# Altium project Motor_Driver_Module.PrjPCB
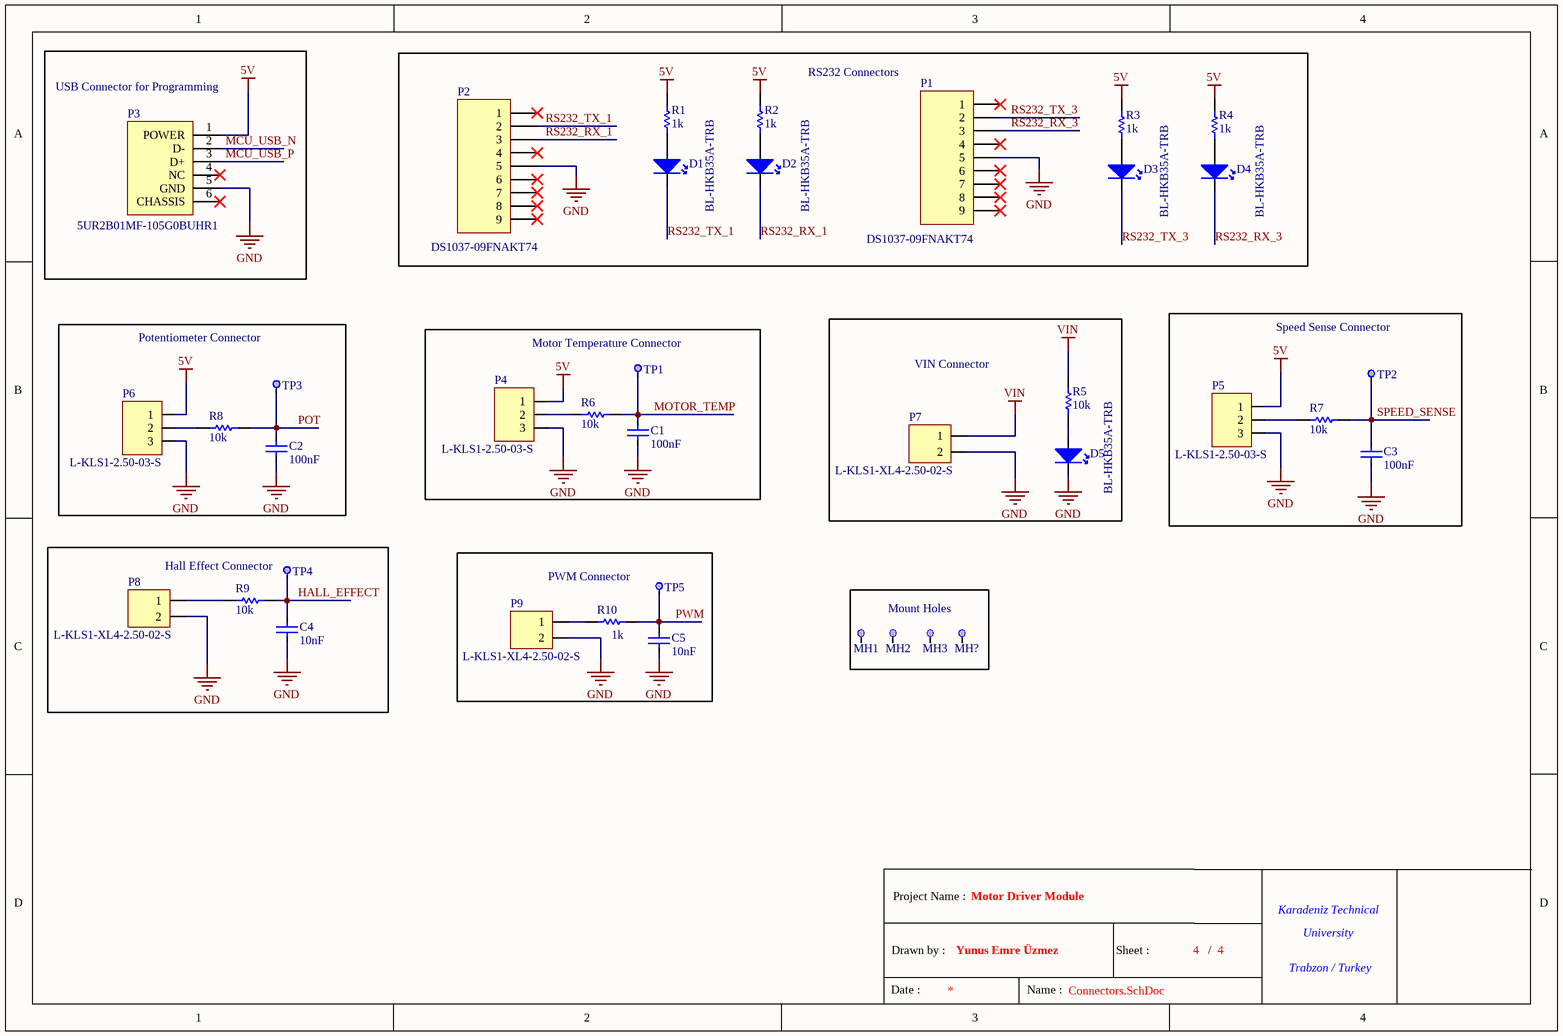
[diagram p0: Connectors.SchDoc]
Person: Yunus Emre Üzmez; Project: Motor Driver Module
4 sheets, 92 parts. Net scope: global (net labels, ports and power ports of the same name join across sheets).
Board file: Motor_Driver_Module.PcbDoc
Sheets:
  Connectors.SchDoc
  Peripheral.SchDoc
  MCU.SchDoc
  Power.SchDoc

## Sheet Connectors.SchDoc
size A4; DocumentNumber: 4; SheetNumber: 4; SheetTotal: 4

### Parts
(Parts that share a designator on the sheet are numbered #1, #2 ... from top to bottom, then left to right.)
?#1  (no value)  (graphical)
C1  100nF  [CAP-0603]
C2  100nF  [CAP-0603]
C3  100nF  [CAP-0603]
C4  10nF  [CAP-0603]
C5  10nF  [CAP-0603]
D1  BL-HKB35A-TRB  [LED-0805]
D2  BL-HKB35A-TRB  [LED-0805]
D3  BL-HKB35A-TRB  [LED-0805]
D4  BL-HKB35A-TRB  [LED-0805]
D5  BL-HKB35A-TRB  [LED-0805]
MH1  3mm Mounting Hole  [3mm Mounting Hole]  (value not drawn)  (no BOM)
MH2  3mm Mounting Hole  [3mm Mounting Hole]  (value not drawn)  (no BOM)
MH3  3mm Mounting Hole  [3mm Mounting Hole]  (value not drawn)  (no BOM)
MH?  3mm Mounting Hole  [3mm Mounting Hole]  (value not drawn)  (no BOM)
P1  DS1037-09FNAKT74  [D SUB 9PIN FEMALE 90C TH]
P2  DS1037-09FNAKT74  [D SUB 9PIN FEMALE 90C TH]
P3  5UR2B01MF-105G0BUHR1  [MICRO USB B SMD]
P4  L-KLS1-2.50-03-S  [3PIN MALE 180C TH 2.5mm]
P5  L-KLS1-2.50-03-S  [3PIN MALE 180C TH 2.5mm]
P6  L-KLS1-2.50-03-S  [3PIN MALE 180C TH 2.5mm]
P7  L-KLS1-XL4-2.50-02-S  [2 PIN MALE 180C TH 2.50MM]
P8  L-KLS1-XL4-2.50-02-S  [2 PIN MALE 180C TH 2.50MM]
P9  L-KLS1-XL4-2.50-02-S  [2 PIN MALE 180C TH 2.50MM]
R1  1k  [RES-0603]
R2  1k  [RES-0603]
R3  1k  [RES-0603]
R4  1k  [RES-0603]
R5  10k  [RES-0603]
R6  10k  [RES-0603]
R7  10k  [RES-0603]
R8  10k  [RES-0603]
R9  10k  [RES-0603]
R10  1k  [RES-0603]
TP1  Test Point  [0.8mm Test Point]  (value not drawn)  (no BOM)
TP2  Test Point  [0.8mm Test Point]  (value not drawn)  (no BOM)
TP3  Test Point  [0.8mm Test Point]  (value not drawn)  (no BOM)
TP4  Test Point  [0.8mm Test Point]  (value not drawn)  (no BOM)
TP5  Test Point  [0.8mm Test Point]  (value not drawn)  (no BOM)

### Blocks framed on the sheet
USB Connector for Programming: P3
RS232 Connectors: D1-D4 P1 P2 R1-R4
Potentiometer Connector: C2 P6 R8 TP3
Motor Temperature Connector: C1 P4 R6 TP1
VIN Connector: D5 P7 R5
Speed Sense Connector: C3 P5 R7 TP2
Hall Effect Connector: C4 P8 R9 TP4
PWM Connector: C5 P9 R10 TP5
Mount Holes: MH1-MH3 MH?

### Nets
5V: P3.1(POWER) P4.1 P5.1 P6.1 R1.2 R2.2 R3.2 R4.2
GND: C1.1 C2.1 C3.1 C4.1 C5.2 D5.2(K) P1.5 P2.5 P3.5(GND) P4.3 P5.3 P6.3 P7.2 P8.2 P9.2
VIN: P7.1 R5.2
HALL_EFFECT: C4.2 R9.2 TP4.1
MCU_USB_N: P3.2(D-)
MCU_USB_P: P3.3(D+)
MOTOR_TEMP: C1.2 R6.2 TP1.1
POT: C2.2 R8.2 TP3.1
PWM: C5.1 R10.2 TP5.1
RS232_RX_1: D2.2(K) P2.3
RS232_RX_3: D4.2(K) P1.3
RS232_TX_1: D1.2(K) P2.2
RS232_TX_3: D3.2(K) P1.2
SPEED_SENSE: C3.2 R7.2 TP2.1
NetD1_1: D1.1(A) R1.1
NetD2_1: D2.1(A) R2.1
NetD3_1: D3.1(A) R3.1
NetD4_1: D4.1(A) R4.1
NetD5_1: D5.1(A) R5.1
NetP4_2: P4.2 R6.1
NetP5_2: P5.2 R7.1
NetP6_2: P6.2 R8.1
NetP8_1: P8.1 R9.1
NetP9_1: P9.1 R10.1

Not connected (* = marked no-connect by the designer): MH1 1; MH2 1; MH3 1; MH? 1; P1 1* 4* 6* 7* 8* 9*; P2 1* 4* 6* 7* 8* 9*; P3 4(NC)* 6(CHASSIS)*

### Notes on the sheet
- Project Name :
- Karadeniz Technical
- Date :
- Drawn by :
- Name :
- Sheet :
- /
- University
- Trabzon / Turkey

### Library data of the parts
?#1 = Title Block: Standart Title Block
C1-C3 = CGA3E2X7R1H104K080AA: Manufacturer: TDK; Temperature Coefficient: X7R; Voltage: 50V; Library Reference: Capacitor; Tolerance: %10; Man Code: CGA3E2X7R1H104K080AA; Value: 100nF; Footprint: 0603; Component Type: Ceramic Capacitor
C4 C5 = 06031C103K4T4A: Manufacturer: AVX; Temperature Coefficient: X7R; Voltage: 100V; Library Reference: Capacitor; Tolerance: %10; Man Code: 06031C103K4T4A; Value: 10nF; Footprint: 0603; Component Type: Ceramic Capacitor
D1-D5 = BL-HKB35A-TRB: Manufacturer: BRIGHT LED; Colour: Yellow; Vf: 2.2V; Library Reference: Miscellaneous; Luminous Intensity: 94mcd; If: 20mA; Lens Transparency: Water Clear; Man Code: BL-HKB35A-TRB; Footprint: 0805; Component Type: Led
MH1-MH3 MH? = 3mm Mounting Hole: Library Reference: Miscellaneous; Component Type: Mounting Hole
P1 P2 = DS1037-09FNAKT74: Manufacturer: CONNFLY; Library Reference: Connector; Mating Connector: L-KLS1-213-09-M-L; Gender: Female; Contact Number: 9; Number of Row: 2; Mounting Angle: 90; Current(max): 1.5A; Contact Resistance(max): 20mohm; Pitch: 2.77mm; Man Code: DS1037-09FNAKT74; Component Type: D SUB 9 PIN Female Connector; Mounting Style: Through Hole
P3 = 5UR2B01MF-105G0BUHR1: Manufacturer: AMTEK; Library Reference: Connector; Mating Connector: MICRO USB B; Gender: Female; Contact Number: 5; Number of Row: 1; Mounting Angle: 90; Current(max): 1A; Contact Resistance(max): 30mohm; Pitch: 0.65mm; Man Code: 5UR2B01MF-105G0BUHR1; Component Type: MICRO USB B Connector; Mounting Style: SMD
P4-P6 = L-KLS1-2.50-03-S: Manufacturer: KLS ELECTRONIC; Library Reference: Connector; Mating Connector: L-KLS1-2.50-03-H; Gender: Male; Contact Number: 3; Number of Row: 1; Mounting Angle: 180; Current(max): 3A; Contact Resistance(max): 10mohm; Pitch: 2.5mm; Man Code: L-KLS1-2.50-03-S; Component Type: CONN 3PIN MALE 180C TH 2.5mm; Mounting Style: Through Hole
P7-P9 = L-KLS1-XL4-2.50-02-S: Manufacturer: KLS ELECTRONIC; Contact Number: 3; Contact Resistance (Max): 10mohm; Current(Max): 3A; Gender: Male; Mounting Angle: 180; Number of Row: 1; Pitch: 2.50mm; Component Type: CONN 2PIN MALE 180C TH 2.5mm; Mounting Style: THT; Man Code: L-KLS1-XL4-2.50-02-S
R1-R4 = CRCW06031K00FKEAC: Manufacturer: Vishay; Tolerance: %1; Power: 0.1W; Library Reference: Resistor; Man Code: CRCW06031K00FKEAC; Value: 1k; Footprint: 0603; Component Type: Chip Resistor
R5-R9 = CRCW060310K0FKEA: Manufacturer: Vishay; Tolerance: %1; Power: 0.1W; Library Reference: Resistor; Man Code: CRCW060310K0FKEA; Value: 10k; Footprint: 0603; Component Type: Chip Resistor
R10 = CRCW06031K00FKEAC: Manufacturer: Vishay; Library Reference: Resistor; Tolerance: %1; Power: 0.1W; Man Code: CRCW06031K00FKEAC; Footprint: 0603; Component Type: Chip Resistor; Value: 1k
TP1-TP5 = Test Point: Library Reference: Miscellaneous; Component Type: Test Point

## Sheet Peripheral.SchDoc
size A4; DocumentNumber: 3; SheetNumber: 3; SheetTotal: 4
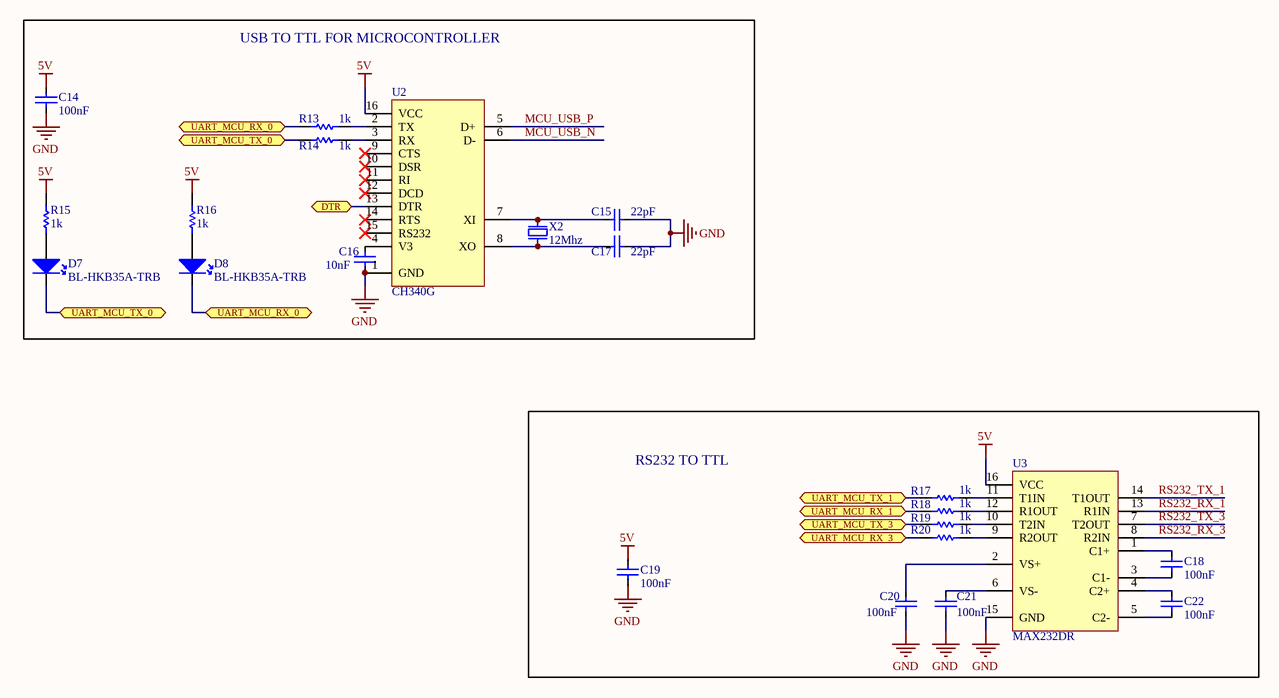
[diagram p1: Peripheral.SchDoc]

### Parts
(Parts that share a designator on the sheet are numbered #1, #2 ... from top to bottom, then left to right.)
?#2  (no value)  (graphical)
C14  100nF  [CAP-0603]
C15  22pF  [CAP-0805]
C16  10nF  [CAP-0603]
C17  22pF  [CAP-0805]
C18  100nF  [CAP-0603]
C19  100nF  [CAP-0603]
C20  100nF  [CAP-0603]
C21  100nF  [CAP-0603]
C22  100nF  [CAP-0603]
D7  BL-HKB35A-TRB  [LED-0805]
D8  BL-HKB35A-TRB  [LED-0805]
R13  1k  [RES-0603]
R14  1k  [RES-0603]
R15  1k  [RES-0603]
R16  1k  [RES-0603]
R17  1k  [RES-0603]
R18  1k  [RES-0603]
R19  1k  [RES-0603]
R20  1k  [RES-0603]
U2  CH340G  [16-SOIC_CH340G]
U3  MAX232DR  [16-SOIC_MAX232DR]
X2  12Mhz  [OSC-THT (11.5*5.00*3.60)]

### Blocks framed on the sheet
USB TO TTL FOR MICROCONTROLLER: C14-C17 D7 D8 R13-R16 U2 X2
RS232 TO TTL: C18-C22 R17-R20 U3

### Ports
DTR (bidir), UART_MCU_RX_0 (bidir), UART_MCU_RX_1 (bidir), UART_MCU_RX_3 (bidir), UART_MCU_TX_0 (bidir), UART_MCU_TX_1 (bidir), UART_MCU_TX_3 (bidir)

### Nets
5V: C14.2 C19.2 R15.2 R16.2 U2.16(VCC) U3.16(VCC)
GND: C14.1 C15.1 C16.1 C17.1 C19.1 C20.1 C21.1 U2.1(GND) U3.15(GND)
MCU_USB_N: U2.6(D-)
MCU_USB_P: U2.5(D+)
RS232_RX_1: U3.13(R1IN)
RS232_RX_3: U3.8(R2IN)
RS232_TX_1: U3.14(T1OUT)
RS232_TX_3: U3.7(T2OUT)
NetC8_2: U2.13(DTR) ; port DTR
NetC15_2: C15.2 U2.7(XI) X2.2
NetC16_2: C16.2 U2.4(V3)
NetC17_2: C17.2 U2.8(XO) X2.1
NetC18_1: C18.1 U3.3(C1-)
NetC18_2: C18.2 U3.1(C1+)
NetC20_2: C20.2 U3.2(VS+)
NetC21_2: C21.2 U3.6(VS-)
NetC22_1: C22.1 U3.5(C2-)
NetC22_2: C22.2 U3.4(C2+)
NetD7_1: D7.1(A) R15.1
NetD7_2: D7.2(K) R14.2 ; port UART_MCU_TX_0
NetD8_1: D8.1(A) R16.1
NetD8_2: D8.2(K) R13.2 ; port UART_MCU_RX_0
NetR13_1: R13.1 U2.2(TX)
NetR14_1: R14.1 U2.3(RX)
NetR17_1: R17.1 U3.11(T1IN)
NetR17_2: R17.2 ; port UART_MCU_TX_1
NetR18_1: R18.1 U3.12(R1OUT)
NetR18_2: R18.2 ; port UART_MCU_RX_1
NetR19_1: R19.1 U3.10(T2IN)
NetR19_2: R19.2 ; port UART_MCU_TX_3
NetR20_1: R20.1 U3.9(R2OUT)
NetR20_2: R20.2 ; port UART_MCU_RX_3

Not connected (* = marked no-connect by the designer): U2 9(CTS)* 10(DSR)* 11(RI)* 12(DCD)* 14(RTS)* 15(RS232)*

### Notes on the sheet
- Project Name :
- Karadeniz Technical
- Date :
- Drawn by :
- Name :
- Sheet :
- /
- University
- Trabzon / Turkey

### Library data of the parts
?#2 = Title Block: Standart Title Block
C14 C18-C22 = CGA3E2X7R1H104K080AA: as C1 on sheet Connectors; Man Code: CGA3E2X7R1H104K080AA; Value: 100nF; Footprint: 0603; Component Type: Ceramic Capacitor
C15 C17 = CL21C220JBANNNC: Manufacturer: Samsung Electro-Mechanics; Temperature Coefficient: C0G; Voltage: 50V; Library Reference: Capacitor; Tolerance: %5; Man Code: CL21C220JBANNNC; Value: 22pF; Footprint: 0805; Component Type: Ceramic Capacitor
C16 = 06031C103K4T4A: as C4 on sheet Connectors; Man Code: 06031C103K4T4A; Value: 10nF; Footprint: 0603; Component Type: Ceramic Capacitor
D7 D8 = BL-HKB35A-TRB: as D1 on sheet Connectors; Man Code: BL-HKB35A-TRB; Footprint: 0805; Component Type: Led
R13-R20 = CRCW06031K00FKEAC: as R1 on sheet Connectors; Man Code: CRCW06031K00FKEAC; Value: 1k; Footprint: 0603; Component Type: Chip Resistor
U2 = CH340G: Library Reference: Integrated_Circuit; Man Code: CH340G; Footprint: 16-SOIC; Component Type: USB-TTL Converter
U3 = MAX232DR: Manufacturer: Texas Instruments; Library Reference: Integrated_Circuit; Data Rate: 120Kbps; Supply Voltage: 4.5V - 5.5V; Man Code: MAX232DR; Footprint: 16-SOIC; Component Type: RS-232 Transceiver
X2 = AS49S-12M-FC160F3: Manufacturer: ANSEN; Frequency Tolerance: 20ppm; Frequency Stability: 50ppm; Library Reference: Miscellaneous; Capacitance: 16pF; ESR: 40ohm; Man Code: AS49S-12M-FC160F3; Value: 12Mhz; Footprint: THT (11.5*5.00*3.60); Component Type: Crystal Oscillator

## Sheet MCU.SchDoc
size A4; DocumentNumber: 1; SheetNumber: 1; SheetTotal: 4
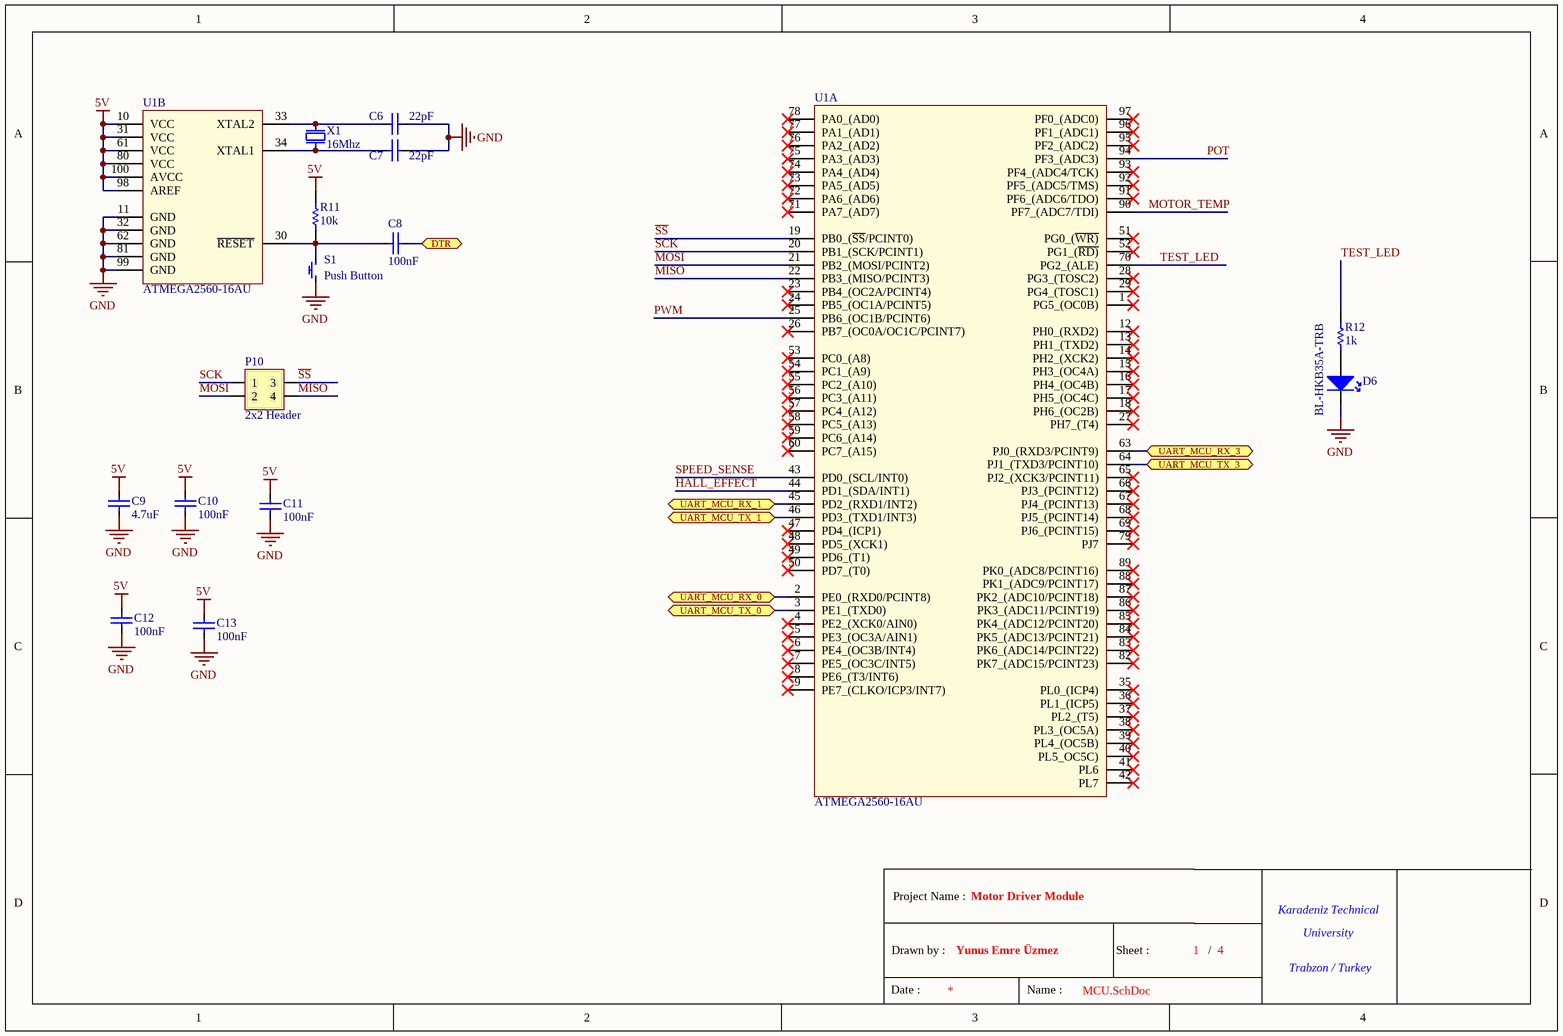
[diagram p2: MCU.SchDoc]

### Parts
(Parts that share a designator on the sheet are numbered #1, #2 ... from top to bottom, then left to right.)
?#3  (no value)  (graphical)
C6  22pF  [CAP-0805]
C7  22pF  [CAP-0805]
C8  100nF  [CAP-0603]
C9  4.7uF  [CAP-0805]
C10  100nF  [CAP-0603]
C11  100nF  [CAP-0603]
C12  100nF  [CAP-0603]
C13  100nF  [CAP-0603]
D6  BL-HKB35A-TRB  [LED-0805]
P10  2x2 Header  [2x2 Header (2.54mm)]
R11  10k  [RES-0603]
R12  1k  [RES-0603]
S1  Push Button  [2.54mm_Push Button]  (no BOM)
U1  ATMEGA2560-16AU  [TQFP-100 Microchip]  (parts A,B of 2)
X1  16Mhz  [OSC-THT (11.5*5.00*3.60)]

### Ports
DTR (bidir), UART_MCU_RX_0 (bidir), UART_MCU_RX_1 (bidir), UART_MCU_RX_3 (bidir), UART_MCU_TX_0 (bidir), UART_MCU_TX_1 (bidir), UART_MCU_TX_3 (bidir)

### Nets
5V: C9.2 C10.2 C11.2 C12.2 C13.2 R11.2 U1.10(VCC) U1.31(VCC) U1.61(VCC) U1.80(VCC) U1.98(AREF) U1.100(AVCC)
GND: C6.1 C7.1 C9.1 C10.1 C11.1 C12.1 C13.1 D6.2(K) S1.1 U1.11(GND) U1.32(GND) U1.62(GND) U1.81(GND) U1.99(GND)
HALL_EFFECT: U1.44(PD1_(SDA/INT1))
MISO: P10.4 U1.22(PB3_(MISO/PCINT3))
MOSI: P10.2 U1.21(PB2_(MOSI/PCINT2))
MOTOR_TEMP: U1.90(PF7_(ADC7/TDI))
POT: U1.94(PF3_(ADC3))
PWM: U1.25(PB6_(OC1B/PCINT6))
~{SS}: P10.3 U1.19(PB0_(~{SS}/PCINT0))
SCK: P10.1 U1.20(PB1_(SCK/PCINT1))
SPEED_SENSE: U1.43(PD0_(SCL/INT0))
TEST_LED: R12.2 U1.70(PG2_(ALE))
NetC6_2: C6.2 U1.33(XTAL2) X1.2
NetC7_2: C7.2 U1.34(XTAL1) X1.1
NetC8_1: C8.1 R11.1 S1.2 U1.30(~{RESET})
NetC8_2: C8.2 ; port DTR
NetD6_1: D6.1(A) R12.1
NetD7_2: U1.3(PE1_(TXD0)) ; port UART_MCU_TX_0
NetD8_2: U1.2(PE0_(RXD0/PCINT8)) ; port UART_MCU_RX_0
NetR17_2: U1.46(PD3_(TXD1/INT3)) ; port UART_MCU_TX_1
NetR18_2: U1.45(PD2_(RXD1/INT2)) ; port UART_MCU_RX_1
NetR19_2: U1.64(PJ1_(TXD3/PCINT10)) ; port UART_MCU_TX_3
NetR20_2: U1.63(PJ0_(RXD3/PCINT9)) ; port UART_MCU_RX_3

Not connected (* = marked no-connect by the designer): U1 1(PG5_(OC0B))* 4(PE2_(XCK0/AIN0))* 5(PE3_(OC3A/AIN1))* 6(PE4_(OC3B/INT4))* 7(PE5_(OC3C/INT5))* 8(PE6_(T3/INT6))* 9(PE7_(CLKO/ICP3/INT7))* 12(PH0_(RXD2))* 13(PH1_(TXD2))* 14(PH2_(XCK2))* 15(PH3_(OC4A))* 16(PH4_(OC4B))* 17(PH5_(OC4C))* 18(PH6_(OC2B))* 23(PB4_(OC2A/PCINT4))* 24(PB5_(OC1A/PCINT5))* 26(PB7_(OC0A/OC1C/PCINT7))* 27(PH7_(T4))* 28(PG3_(TOSC2))* 29(PG4_(TOSC1))* 35(PL0_(ICP4))* 36(PL1_(ICP5))* 37(PL2_(T5))* 38(PL3_(OC5A))* 39(PL4_(OC5B))* 40(PL5_OC5C))* 41(PL6)* 42(PL7)* 47(PD4_(ICP1))* 48(PD5_(XCK1))* 49(PD6_(T1))* 50(PD7_(T0))* 51(PG0_(~{WR)})* 52(PG1_(~{RD)})* 53(PC0_(A8))* 54(PC1_(A9))* 55(PC2_(A10))* 56(PC3_(A11))* 57(PC4_(A12))* 58(PC5_(A13))* 59(PC6_(A14))* 60(PC7_(A15))* 65(PJ2_(XCK3/PCINT11))* 66(PJ3_(PCINT12))* 67(PJ4_(PCINT13))* 68(PJ5_(PCINT14))* 69(PJ6_(PCINT15))* 71(PA7_(AD7))* 72(PA6_(AD6))* 73(PA5_(AD5))* 74(PA4_(AD4))* 75(PA3_(AD3))* 76(PA2_(AD2))* 77(PA1_(AD1))* 78(PA0_(AD0))* 79(PJ7)* 82(PK7_(ADC15/PCINT23))* 83(PK6_(ADC14/PCINT22))* 84(PK5_(ADC13/PCINT21))* 85(PK4_(ADC12/PCINT20))* 86(PK3_(ADC11/PCINT19))* 87(PK2_(ADC10/PCINT18))* 88(PK1_(ADC9/PCINT17))* 89(PK0_(ADC8/PCINT16))* 91(PF6_(ADC6/TDO))* 92(PF5_(ADC5/TMS))* 93(PF4_(ADC4/TCK))* 95(PF2_(ADC2))* 96(PF1_(ADC1))* 97(PF0_(ADC0))*

### Notes on the sheet
- Project Name :
- Karadeniz Technical
- Date :
- Drawn by :
- Name :
- Sheet :
- /
- University
- Trabzon / Turkey

### Library data of the parts
?#3 = Title Block: Standart Title Block
C6 C7 = CL21C220JBANNNC: as C15 on sheet Peripheral; Man Code: CL21C220JBANNNC; Value: 22pF; Footprint: 0805; Component Type: Ceramic Capacitor
C8 C10-C13 = CGA3E2X7R1H104K080AA: as C1 on sheet Connectors; Man Code: CGA3E2X7R1H104K080AA; Value: 100nF; Footprint: 0603; Component Type: Ceramic Capacitor
C9 = C0805C475K3RACAUTO: Manufacturer: Kemet; Temperature Coefficient: X7R; Voltage: 25V; Library Reference: Capacitor; Tolerance: %10; Man Code: C0805C475K3RACAUTO; Value: 4.7uF; Footprint: 0805; Component Type: Ceramic Capacitor
D6 = BL-HKB35A-TRB: as D1 on sheet Connectors; Man Code: BL-HKB35A-TRB; Footprint: 0805; Component Type: Led
P10 = 2x2 Header (2.54mm): Library Reference: Connector; Gender: Male; Contact Number: 4; Number of Row: 2; Mounting Angle: 180; Pitch: 2.54mm; Man Code: 2x2 Header; Component Type: Header; Manufacturer: -; Mating Connector: -; Mounting Style: Through Hole; Current(max): -; Contact Resistance(max): -
R11 = CRCW060310K0FKEA: as R5 on sheet Connectors; Man Code: CRCW060310K0FKEA; Value: 10k; Footprint: 0603; Component Type: Chip Resistor
R12 = CRCW06031K00FKEAC: as R1 on sheet Connectors; Man Code: CRCW06031K00FKEAC; Value: 1k; Footprint: 0603; Component Type: Chip Resistor
S1 = Push Button: Library Reference: Other Switches; Component Type: Push Button
U1 = ATMEGA2560-16AU: Manufacturer: Microchip; Library Reference: Integrated_Circuit; Number Of Bits: 8-Bit; Speed: 16Mhz; Program Memory Size: 256KB; Supply Voltage: 4.5V - 5.5V; Component Type: Microcontroller; Man Code: ATMEGA2560-16AU
X1 = AS49S-16M-FC160F3: Manufacturer: ANSEN; Frequency Tolerance: 20ppm; Frequency Stability: 50ppm; Library Reference: Miscellaneous; Capacitance: 16pF; ESR: 30ohm; Man Code: AS49S-16M-FC160F3; Value: 16Mhz; Component Type: Crystal Oscillator; Footprint: THT (11.5*5.00*3.60)

## Sheet Power.SchDoc
size A4; DocumentNumber: 2; SheetNumber: 2; SheetTotal: 4
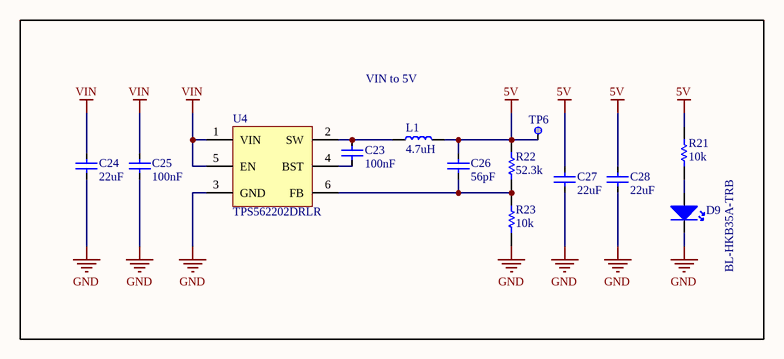
[diagram p3: Power.SchDoc]

### Parts
(Parts that share a designator on the sheet are numbered #1, #2 ... from top to bottom, then left to right.)
?#4  (no value)  (graphical)
C23  100nF  [CAP-0603]
C24  22uF  [CAP-1210]
C25  100nF  [CAP-0603]
C26  56pF  [CAP-0603]
C27  22uF  [CAP-1210]
C28  22uF  [CAP-1210]
D9  BL-HKB35A-TRB  [LED-0805]
L1  4.7uH  [IND_EATON_DR125-4R7-R]
R21  10k  [RES-0603]
R22  52.3k  [RES-0603]
R23  10k  [RES-0603]
TP6  Test Point  [0.8mm Test Point]  (value not drawn)  (no BOM)
U4  TPS562202DRLR  [SOT-563]

### Blocks framed on the sheet
VIN to 5V: C23-C28 D9 L1 R21-R23 TP6 U4

### Nets
5V: C26.2 C27.2 C28.2 L1.2 R21.2 R22.2 TP6.1
GND: C24.1 C25.1 C27.1 C28.1 D9.2(K) R23.1 U4.3(GND)
VIN: C24.2 C25.2 U4.1(VIN) U4.5(EN)
NetC23_1: C23.1 U4.4(BST)
NetC23_2: C23.2 L1.1 U4.2(SW)
NetC26_1: C26.1 R22.1 R23.2 U4.6(FB)
NetD9_1: D9.1(A) R21.1

### Notes on the sheet
- Project Name :
- Karadeniz Technical
- Date :
- Drawn by :
- Name :
- Sheet :
- /
- University
- Trabzon / Turkey

### Library data of the parts
?#4 = Title Block: Standart Title Block
C23 C25 = CGA3E2X7R1H104K080AA: as C1 on sheet Connectors; Man Code: CGA3E2X7R1H104K080AA; Value: 100nF; Footprint: 0603; Component Type: Ceramic Capacitor
C24 C27 C28 = CL32B226KAJNNNE: Manufacturer: Samsung Electro-Mechanics; Temperature Coefficient: X7R; Voltage: 25V; Library Reference: Capacitor; Tolerance: %10; Man Code: CL32B226KAJNNNE; Value: 22uF; Footprint: 1210; Component Type: Ceramic Capacitor
C26 = GCM1885C2A560FA16D: Manufacturer: Murata; Library Reference: Capacitor; Tolerance: %1; Temperature Coefficient: C0G; Voltage: 100V; Man Code: GCM1885C2A560FA16D; Value: 56pF; Footprint: 0603; Component Type: Ceramic Capacitor
D9 = BL-HKB35A-TRB: as D1 on sheet Connectors; Man Code: BL-HKB35A-TRB; Footprint: 0805; Component Type: Led
L1 = DR125-4R7-R: Manufacturer: Eaton; Max Dc Resistance: 10.5mOhm; Tolerance: %20; Max DC Current: 7.18A; Library Reference: Inductor; Man Code: DR125-4R7-R; Value: 4.7uH; Footprint: Surface Mount (12.5mm* 12.5mm); Component Type: Fixed Inductor
R21 R23 = CRCW060310K0FKEA: as R5 on sheet Connectors; Man Code: CRCW060310K0FKEA; Value: 10k; Footprint: 0603; Component Type: Chip Resistor
R22 = ERJ-3EKF5232V: Manufacturer: Panasonic; Tolerance: %1; Power: 0.1W; Library Reference: Resistor; Man Code: ERJ-3EKF5232V; Value: 52.3k; Footprint: 0603; Component Type: Chip Resistor
TP6 = Test Point: Library Reference: Miscellaneous; Component Type: Test Point
U4 = TPS562202DRLR: Manufacturer: Texas Instruments; Library Reference: Integrated_Circuit; Man Code: TPS562202DRLR; Component Type: Switcher

## Nets that join several sheets
5V: Connectors (8 pins), Peripheral (6 pins), MCU (12 pins), Power (7 pins)
GND: Connectors (15 pins), Peripheral (9 pins), MCU (14 pins), Power (7 pins)
VIN: Connectors (P7.1 R5.2), Power (C24.2 C25.2 U4.1 U4.5)
HALL_EFFECT: Connectors (C4.2 R9.2 TP4.1), MCU (U1.44)
MCU_USB_N: Connectors (P3.2), Peripheral (U2.6)
MCU_USB_P: Connectors (P3.3), Peripheral (U2.5)
MOTOR_TEMP: Connectors (C1.2 R6.2 TP1.1), MCU (U1.90)
NetC8_2: Peripheral (U2.13), MCU (C8.2)
NetD7_2: Peripheral (D7.2 R14.2), MCU (U1.3)
NetD8_2: Peripheral (D8.2 R13.2), MCU (U1.2)
NetR17_2: Peripheral (R17.2), MCU (U1.46)
NetR18_2: Peripheral (R18.2), MCU (U1.45)
NetR19_2: Peripheral (R19.2), MCU (U1.64)
NetR20_2: Peripheral (R20.2), MCU (U1.63)
POT: Connectors (C2.2 R8.2 TP3.1), MCU (U1.94)
PWM: Connectors (C5.1 R10.2 TP5.1), MCU (U1.25)
RS232_RX_1: Connectors (D2.2 P2.3), Peripheral (U3.13)
RS232_RX_3: Connectors (D4.2 P1.3), Peripheral (U3.8)
RS232_TX_1: Connectors (D1.2 P2.2), Peripheral (U3.14)
RS232_TX_3: Connectors (D3.2 P1.2), Peripheral (U3.7)
SPEED_SENSE: Connectors (C3.2 R7.2 TP2.1), MCU (U1.43)